# EasyEDA Pro project 南大单个电容计V1.0_SCH.eprj

# Schematic Cap_Meter

## Sheets
1 power
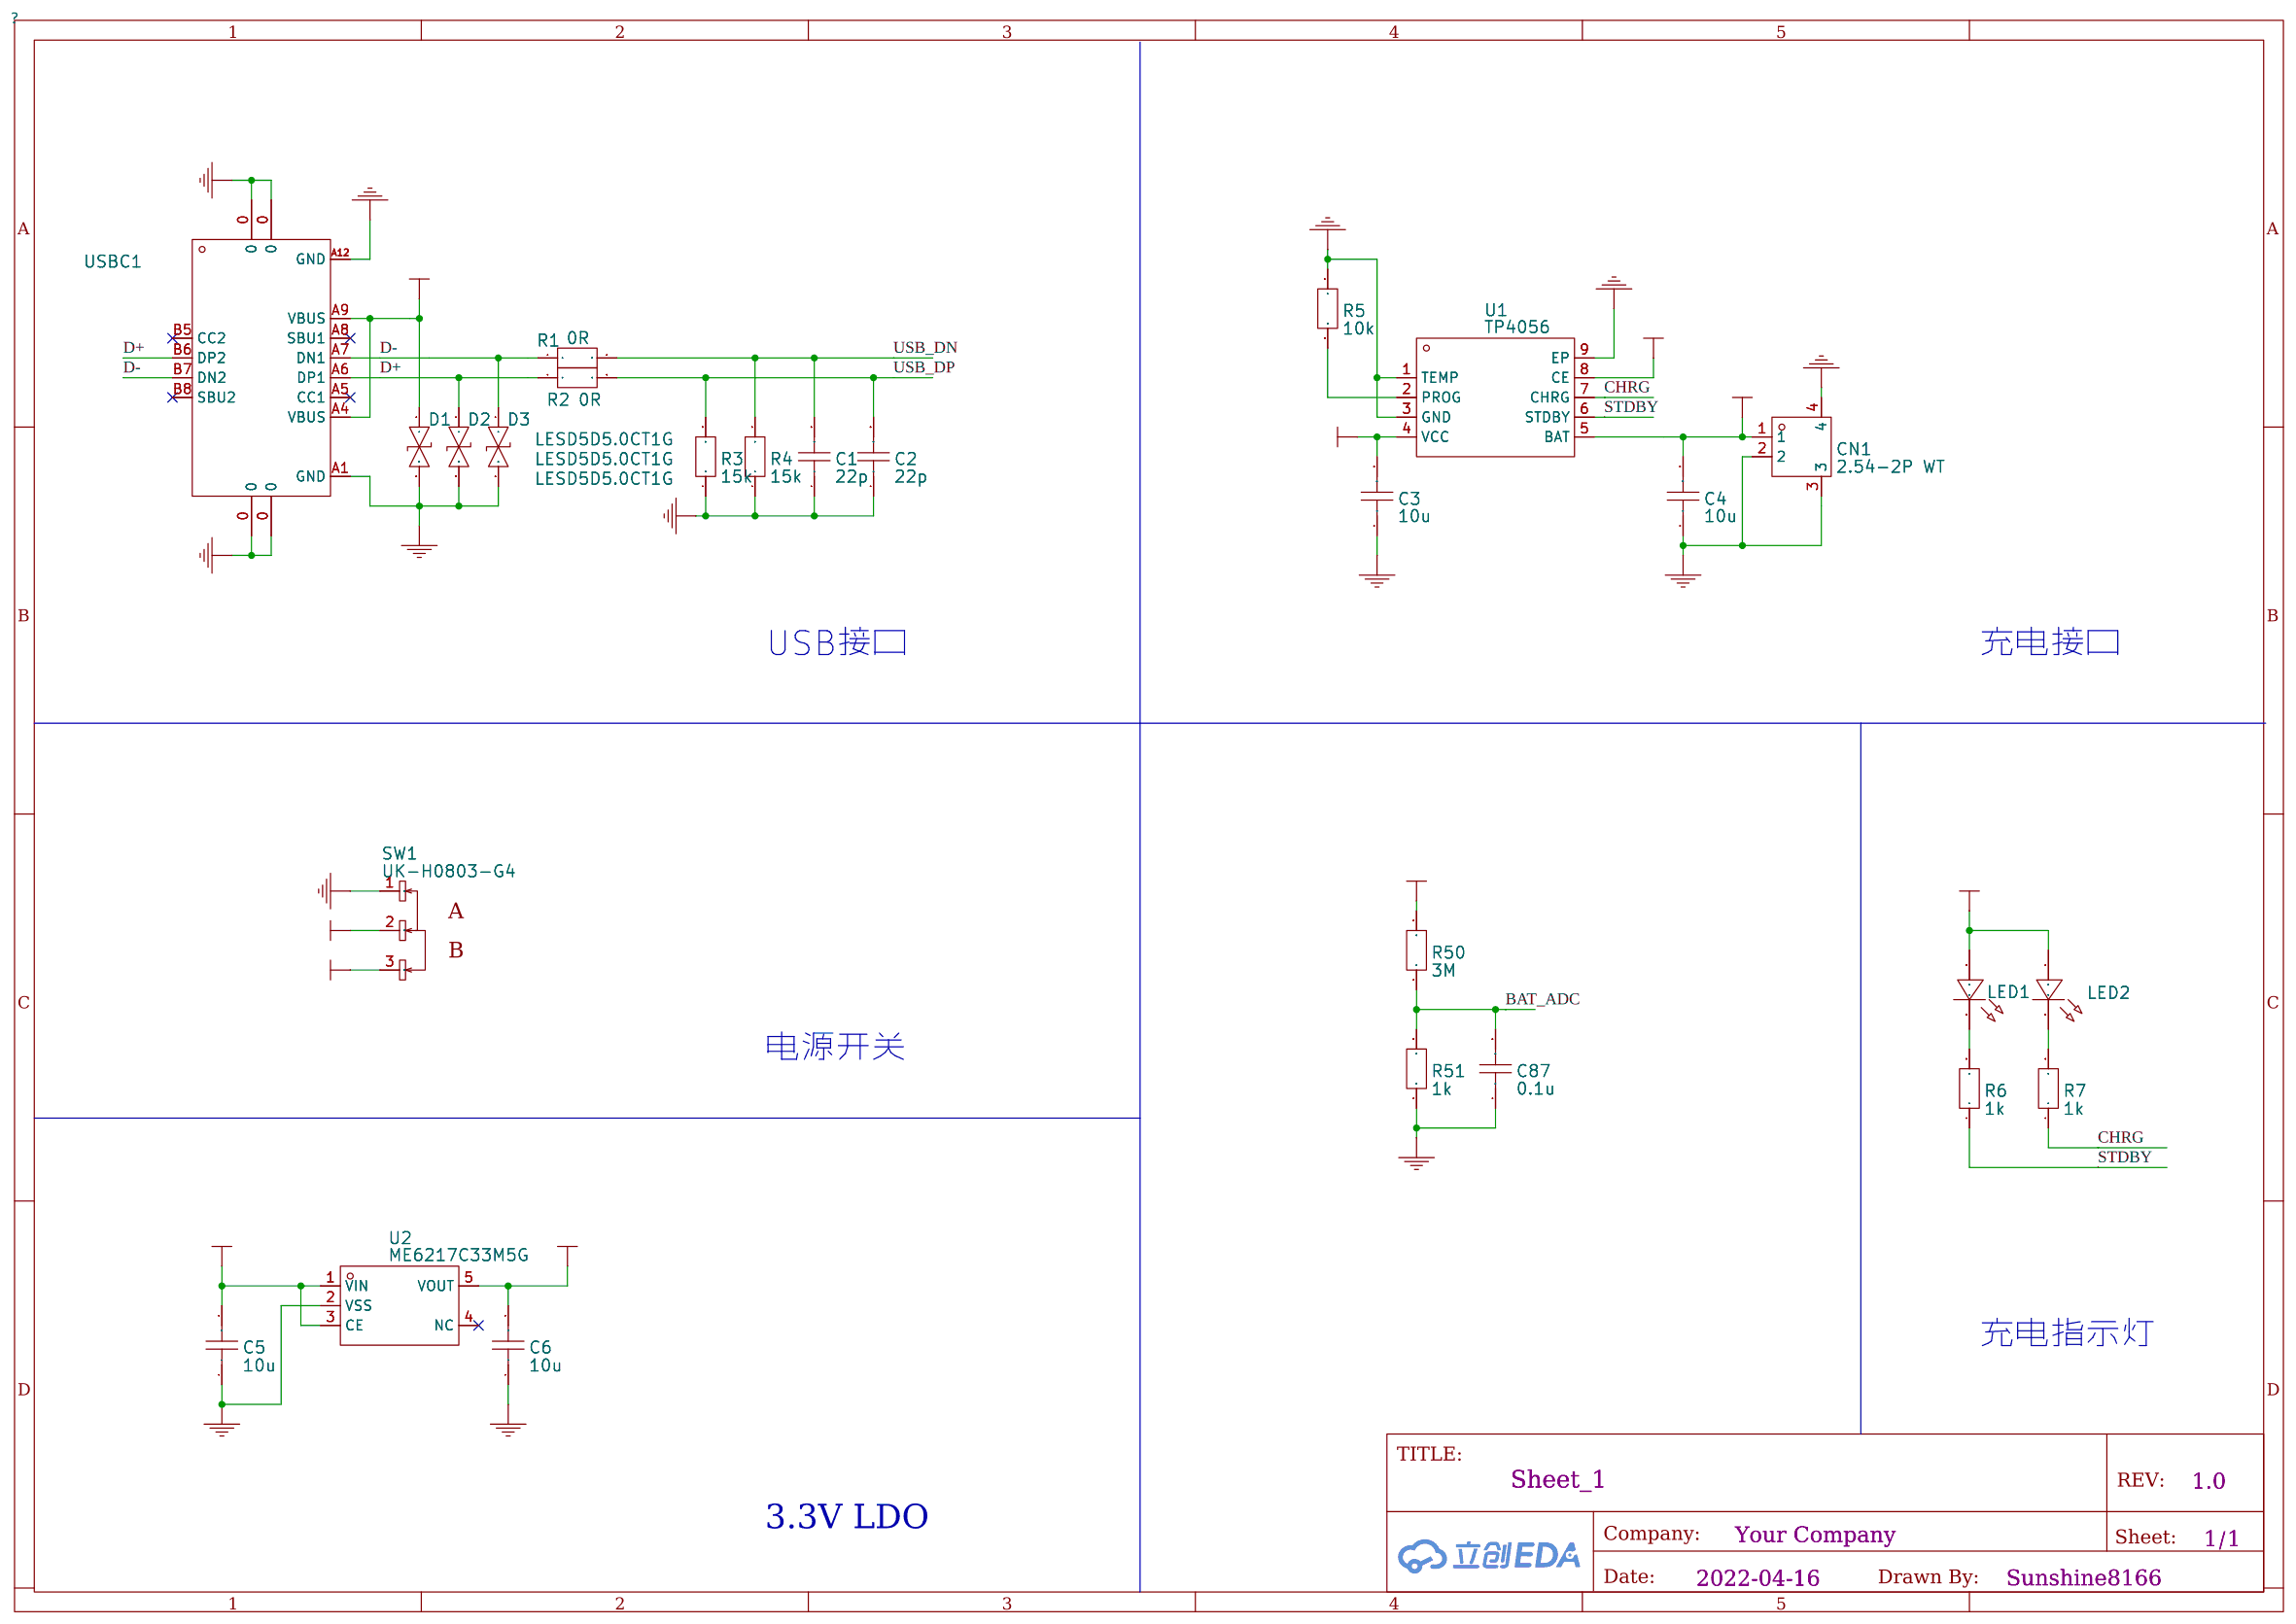
[diagram p0: power]
2 core
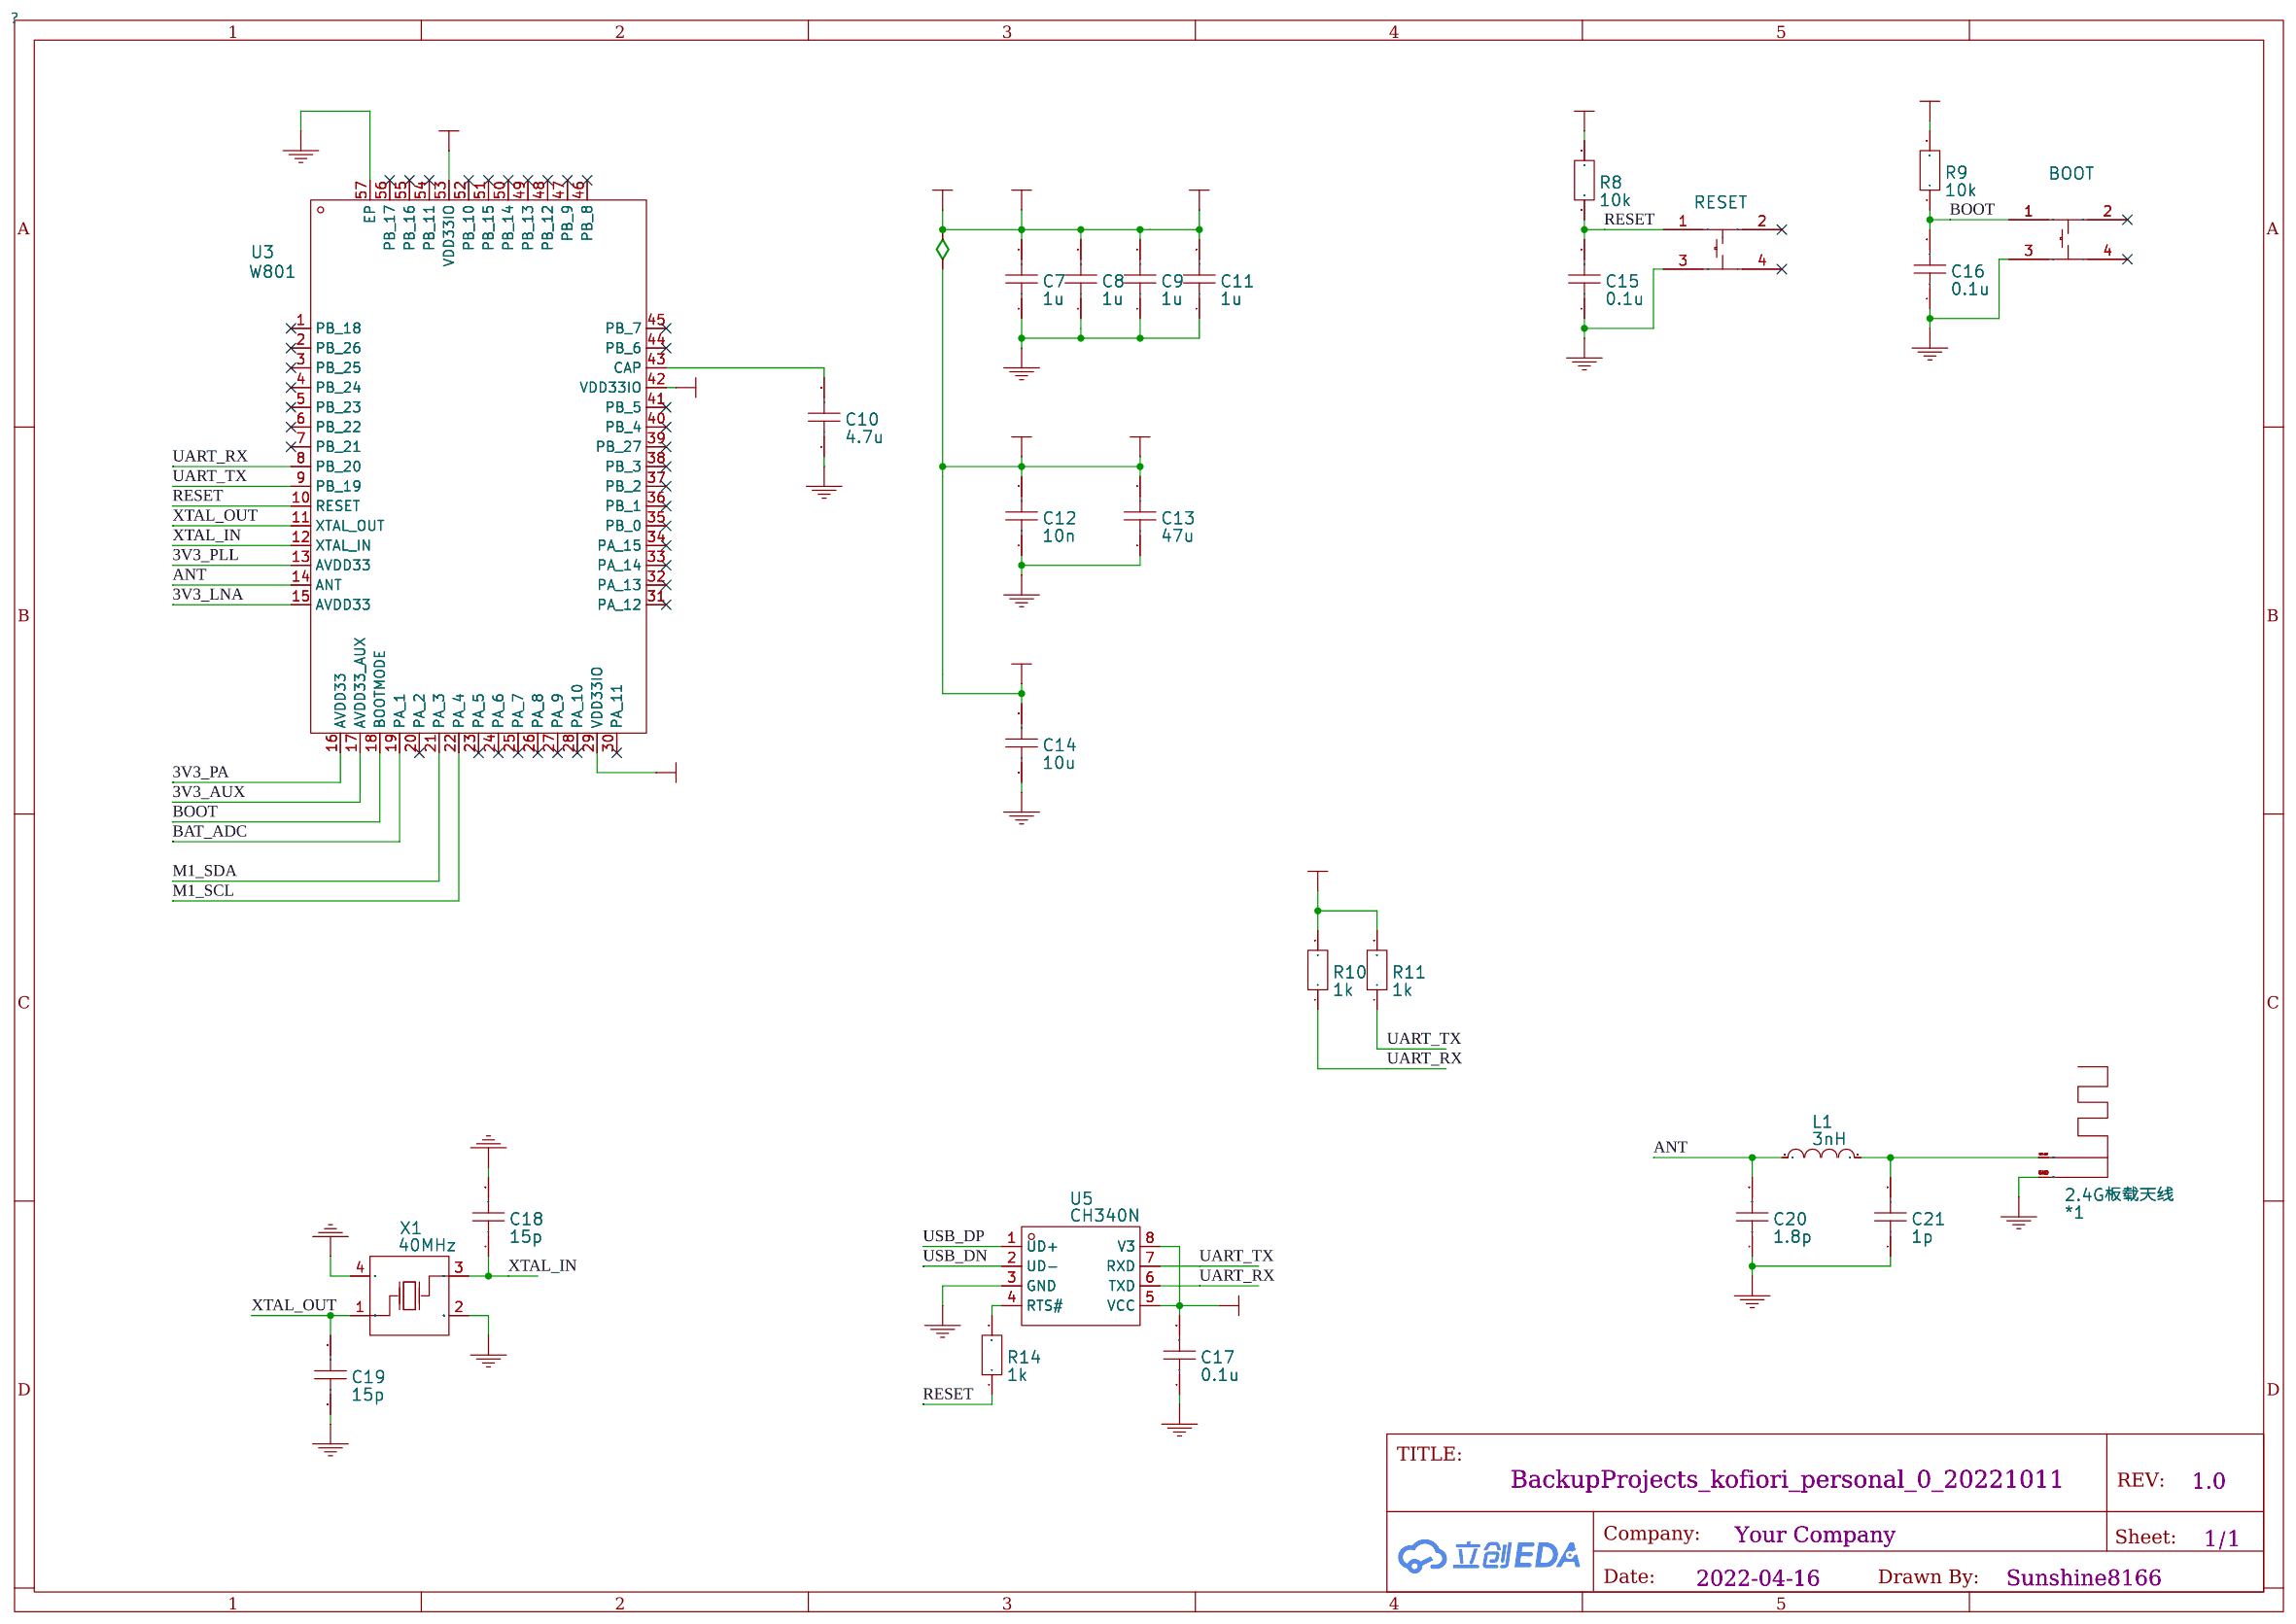
[diagram p1: core]
3 measure1
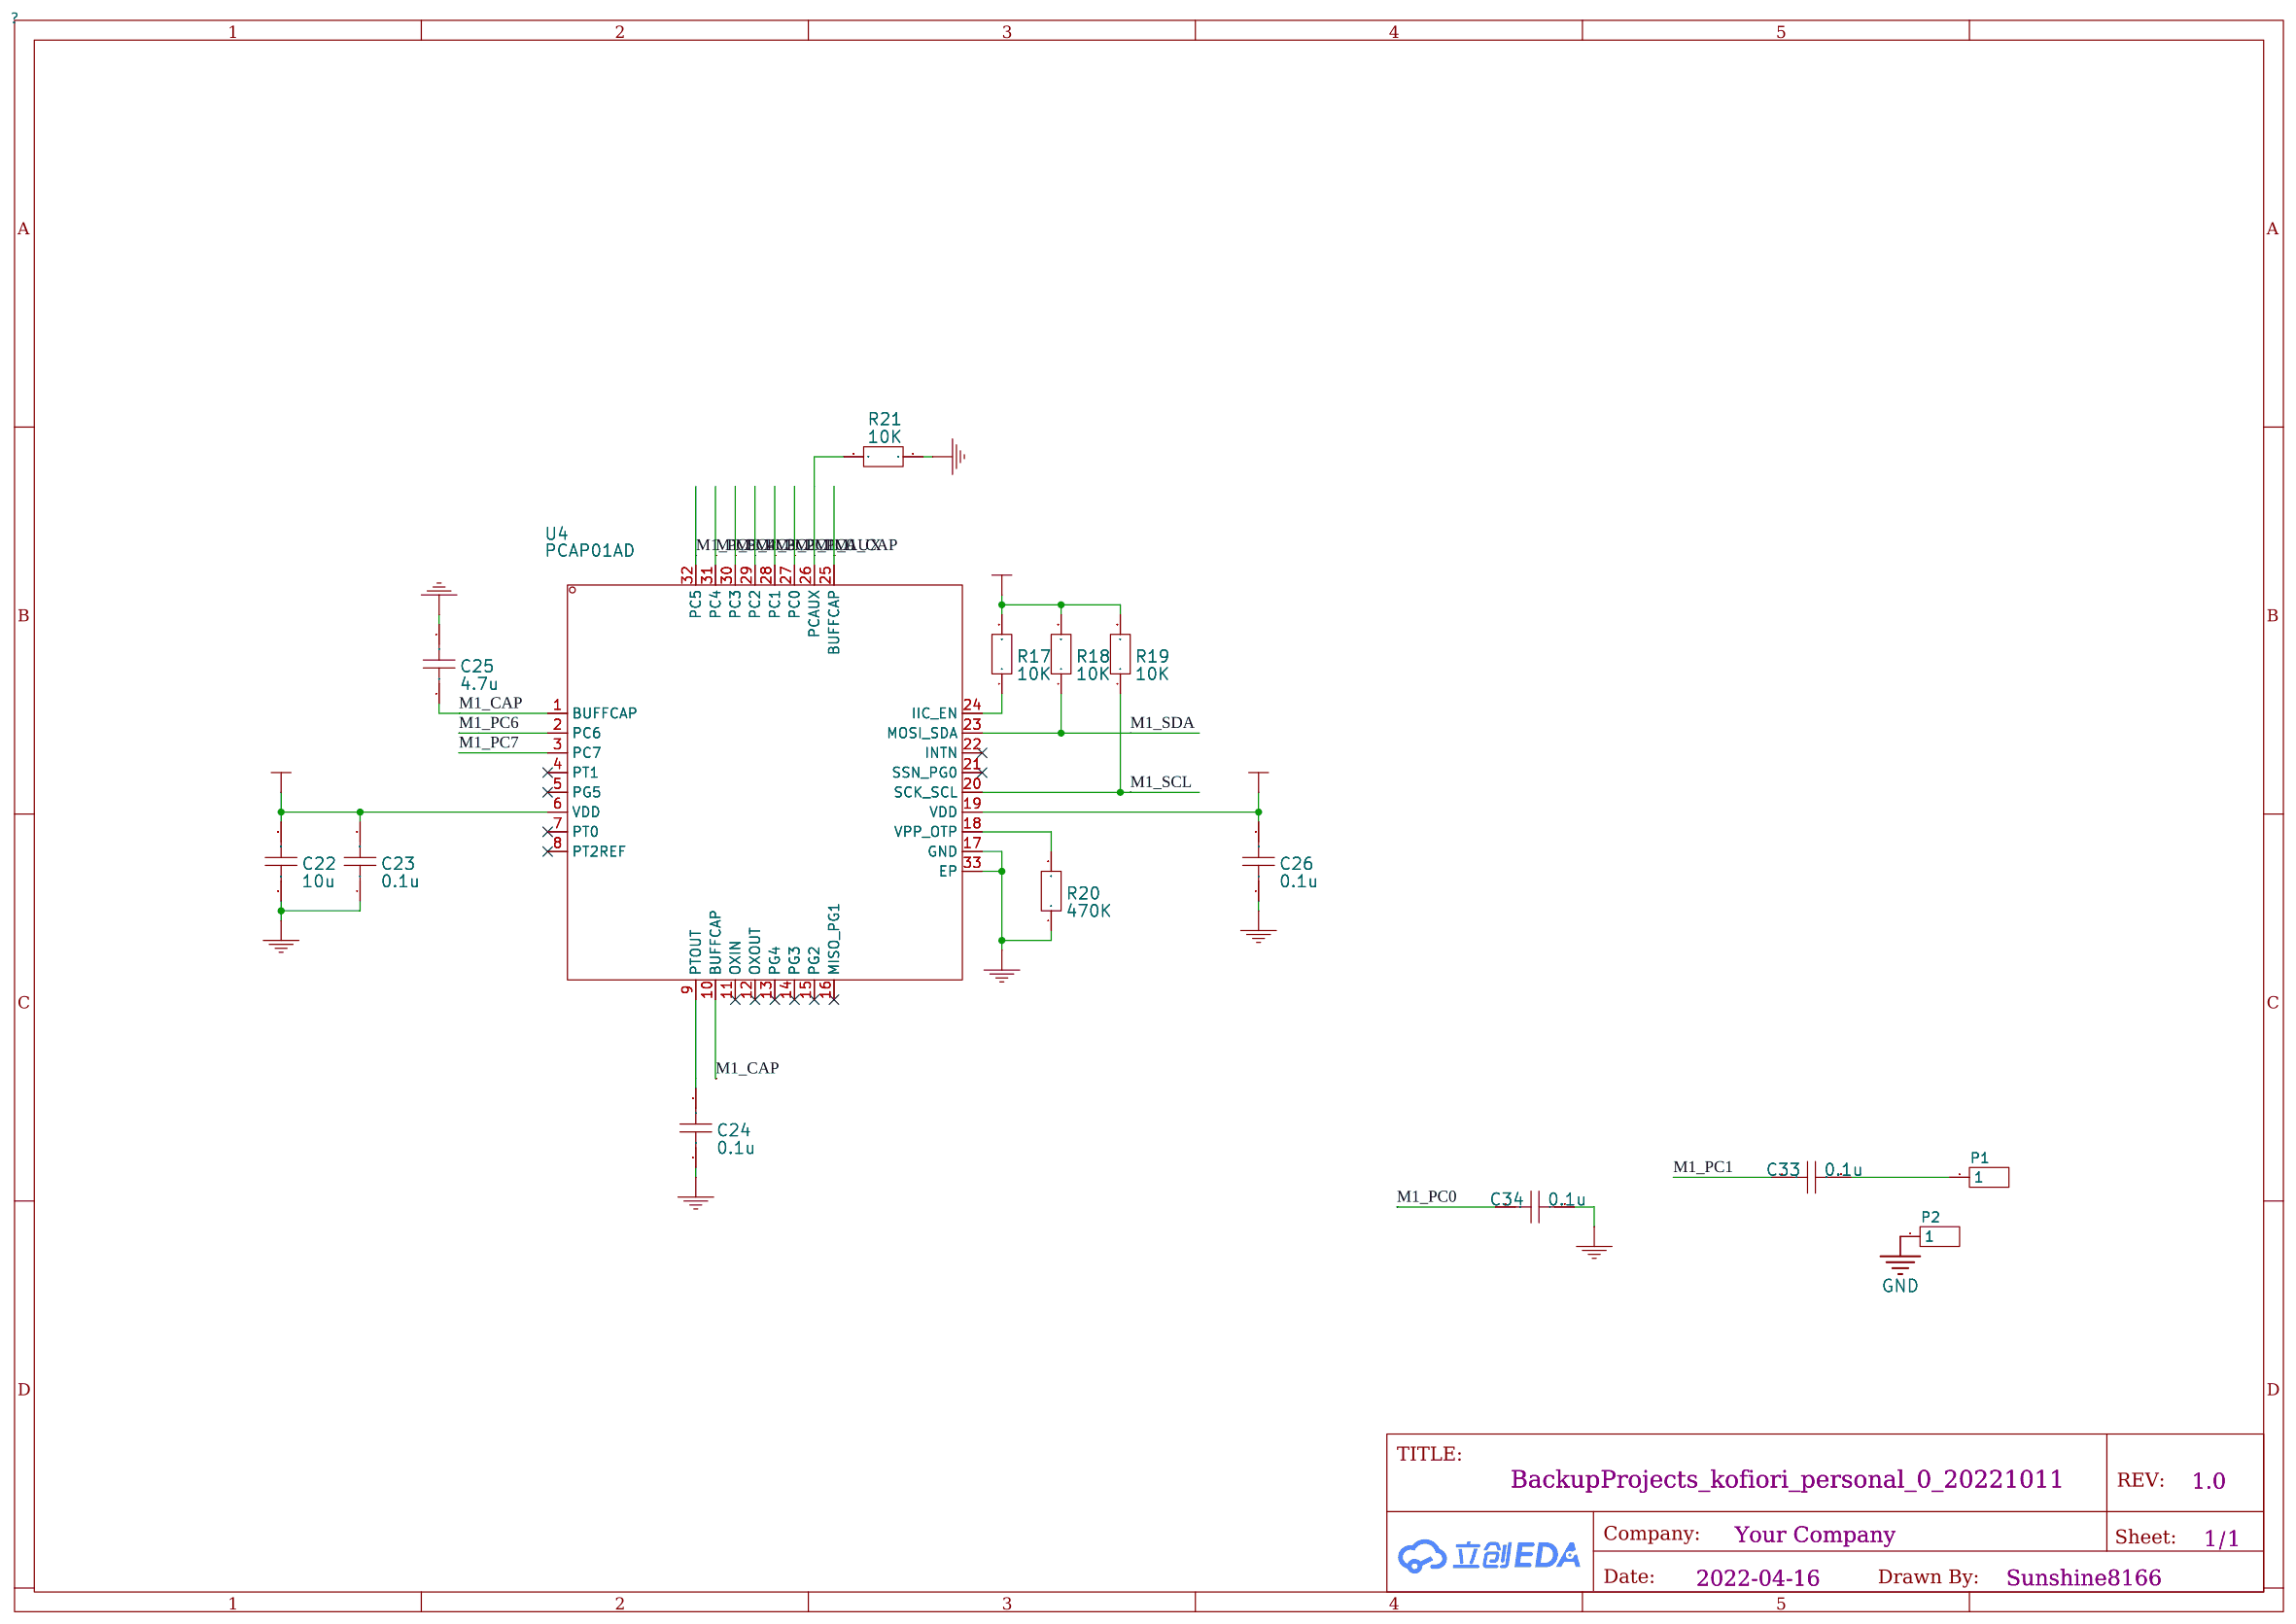
[diagram p2: measure1]

## Parts
sheet core
*1  2.4G板载天线  [2.4G天线（ESP8266板载）左]
BOOT  PTS815SJK250SMTRLFS  [SW-SMD_4P-L4.2-W3.3-P2.15-LS5.1]
C7  1u  [C0402]
C8  1u  [C0402]
C9  1u  [C0402]
C10  4.7u  [C0402]
C11  1u  [C0402]
C12  10n  [C0402]
C13  47u  [C0603]
C14  10u  [C0603]
C15  0.1u  [C0402]
C16  0.1u  [C0402]
C17  0.1u  [C0402]
C18  15p  [C0402]
C19  15p  [C0402]
C20  1.8p  [C0402]
C21  1p  [C0402]
L1  3nH  [L0603]
R8  10k  [R0402]
R9  10k  [R0402]
R10  1k  [R0402]
R11  1k  [R0402]
R14  1k  [R0402]
RESET  PTS815SJK250SMTRLFS  [SW-SMD_4P-L4.2-W3.3-P2.15-LS5.1]
U3  W801  [QFN-56_L6.0-W6.0-P0.35--TL-EP4.7]
U5  CH340N  [SOP-8_L4.9-W3.9-P1.27-LS6.0-BL]
X1  40MHz  [OSC-SMD_4P-L3.2-W2.5-BL_SIT8008BI]
sheet measure1
C22  10u  [C0603]
C23  0.1u  [C0402]
C24  0.1u  [C0402]
C25  4.7u  [C0402]
C26  0.1u  [C0402]
C33  0.1u  [C0402]
C34  0.1u  [C0402]
P1  2.54-1*1P针  [HDR-TH_1P-P2.54-V-M]
P2  2.54-1*1P针  [HDR-TH_1P-P2.54-V-M]
R17  10K  [R0402]
R18  10K  [R0402]
R19  10K  [R0402]
R20  470K  [R0402]
R21  10K  [R0402]
U4  PCAP01AD  [QFN-32_L5.0-W5.0-P0.50-TL-EP]
sheet power
C1  22p  [C0402]
C2  22p  [C0402]
C3  10u  [C0603]
C4  10u  [C0603]
C5  10u  [C0603]
C6  10u  [C0603]
C87  0.1u  [C0402]
CN1  2.54-2P WT  [CONN-SMD_2.54-2PWT]
D1  LESD5D5.0CT1G  [SOD-523_L1.2-W0.8-LS1.6-BI]
D2  LESD5D5.0CT1G  [SOD-523_L1.2-W0.8-LS1.6-BI]
D3  LESD5D5.0CT1G  [SOD-523_L1.2-W0.8-LS1.6-BI]
LED1  LED-0603_G  [LED0603_GREEN]
LED2  LED-0603_R  [LED0603_RED]
R1  0R  [R0402]
R2  0R  [R0402]
R3  15k  [R0402]
R4  15k  [R0402]
R5  10k  [R0402]
R6  1k  [R0402]
R7  1k  [R0402]
R50  3M  [R0402]
R51  1k  [R0402]
SW1  UK-H0803-G4  [SW-TH_3P-L9.1-W3.5-P2.50-A3]
U1  TP4056  [ESOP-8_L4.9-W3.9-P1.27-LS6.0-BL-EP]
U2  ME6217C33M5G  [SOT-23-5_L3.0-W1.7-P0.95-LS2.8-BR]
USBC1  USB3.1C16PFSMT  [USB-C-SMD_TYPE-C-USB-17]

## Library data of the parts
*1 = 2.4G板载天线: Supplier: TTOOAADD
BOOT RESET = PTS815SJK250SMTRLFS: link: https://item.szlcsc.com/457637.html; 3DModel: SW-SMD_4P-L4.2-W3.3-H2.5-P2.15-LS5.1; Supplier: LCSC; Supplier Part: C918859; Manufacturer: C&K; JLCPCB Part Class: Extended Part
C7-C9 C11 = 1u: link: https://item.szlcsc.com/15869.html; 3DModel: C0402_L1.0-W0.5-H0.5
C10 C25 = 4.7u: link: https://item.szlcsc.com/15869.html; 3DModel: C0402_L1.0-W0.5-H0.5
C12 = 10n: link: https://item.szlcsc.com/15869.html; 3DModel: C0402_L1.0-W0.5-H0.5
C13 = 47u: link: https://item.szlcsc.com/362304.html; 3DModel: C0603_L1.6-W0.8-H0.8
C3-C6 C14 C22 = 10u: link: https://item.szlcsc.com/362304.html; 3DModel: C0603_L1.6-W0.8-H0.8
C15-C17 C23 C24 C26 C33 C34 C87 = 0.1u: link: https://item.szlcsc.com/15869.html; 3DModel: C0402_L1.0-W0.5-H0.5
C18 C19 = 15p: link: https://item.szlcsc.com/15869.html; 3DModel: C0402_L1.0-W0.5-H0.5
C20 = 1.8p: link: https://item.szlcsc.com/15869.html; 3DModel: C0402_L1.0-W0.5-H0.5
C21 = 1p: link: https://item.szlcsc.com/15869.html; 3DModel: C0402_L1.0-W0.5-H0.5
L1 = 3nH: link: https://item.szlcsc.com/344093.html; 3DModel: L0603_L1.6-W0.8-H0.5_BEAD
R5 R8 R9 = 10k: link: https://item.szlcsc.com/323315.html; 3DModel: R0402_L1.0-W0.5-H0.5
R6 R7 R10 R11 R14 R51 = 1k: link: https://item.szlcsc.com/323315.html; 3DModel: R0402_L1.0-W0.5-H0.5
U3 = W801: link: https://atta.szlcsc.com/upload/public/pdf/source/20211213/F4F81DC76592C5525AB14E3D832A4B86.pdf; Supplier: LCSC; Supplier Part: C2929888; Manufacturer: WinnerMicro(联盛德); JLCPCB Part Class: Extended Part
U5 = CH340N: link: https://item.szlcsc.com/383602.html; 3DModel: SOP-8_L4.9-W3.9-H1.45-LS6.0-P1.27; Supplier: LCSC; Supplier Part: C2977777; Manufacturer: WCH(南京沁恒); JLCPCB Part Class: Extended Part
X1 = 40MHz: link: https://item.szlcsc.com/264073.html; 3DModel: OSC-SMD_4P-L3.2-W2.5-H1.0; Supplier: LCSC; Manufacturer: YXC; Manufacturer Part: X322540MPB4SI; Supplier Part: C9010; JLCPCB Part Class: Extended Part
P1 P2 = 2.54-1*1P针: 间距:-;总PIN位数:1;排数:1;插针结构:-;行距:-;安装类型:直插;圆针/方针:-;额定电流:-;额定电压:-;配合针长度:-;塑高:-;触头材质:-;触头镀层:-;颜色:黑色;; LCSC Part Name: 直插; Supplier Part: C81276; Manufacturer: BOOMELE(博穆精密); Supplier Footprint: 插件; JLCPCB Part Class: Extended Part; Datasheet: https://atta.szlcsc.comnull; Supplier: LCSC; Number of Pins: 1; Number of Rows: 1; Mounting Type: 直插; Color: 黑色
R17-R19 R21 = 10K: link: https://item.szlcsc.com/323315.html; 3DModel: R0402_L1.0-W0.5-H0.5
R20 = 470K: link: https://item.szlcsc.com/323315.html; 3DModel: R0402_L1.0-W0.5-H0.5
U4 = PCAP01AD: link: https://item.szlcsc.com/18002.html; 3DModel: QFN-32_L5.0-W5.0-H1.0-P0.50-TL-EP; Supplier: LCSC; Supplier Part: C192738; Manufacturer: Ams AG; JLCPCB Part Class: Extended Part
C1 C2 = 22p: link: https://item.szlcsc.com/15869.html; 3DModel: C0402_L1.0-W0.5-H0.5
CN1 = 2.54-2P WT: link: https://item.szlcsc.com/698565.html; 3DModel: CONN-SMD_XH2.50-WS-2P; Supplier: LCSC; Supplier Part: C668622; Manufacturer: SHOU HAN; JLCPCB Part Class: Extended Part
D1-D3 = LESD5D5.0CT1G: link: https://lcsc.com/product-detail/TVS_ESD5Z5V0C_C129211.html; 3DModel: SOD-523_L1.2-W0.8-H0.7-LS1.6; Supplier: LCSC; Supplier Part: C383211; Manufacturer: Leshan Radio; JLCPCB Part Class: Extended Part
LED1 = LED-0603_G: 3DModel: LED0603-RD_GREEN; Manufacturer: EVERLIGHT(台湾亿光); Manufacturer Part: 19-217/GHC-YR1S2/3T; Supplier Part: C72043; Supplier: LCSC
LED2 = LED-0603_R: 3DModel: LED0603_Red; Manufacturer: EVERLIGHT(台湾亿光); Manufacturer Part: 19-217/R6C-AL1M2VY/3T; Supplier Part: C72044; Supplier: LCSC
R1 R2 = 0R: link: https://item.szlcsc.com/323315.html; 3DModel: R0402_L1.0-W0.5-H0.5
R3 R4 = 15k: link: https://item.szlcsc.com/323315.html; 3DModel: R0402_L1.0-W0.5-H0.5
R50 = 3M: link: https://item.szlcsc.com/323315.html; 3DModel: R0402_L1.0-W0.5-H0.5
SW1 = UK-H0803-G4: link: https://item.szlcsc.com/529145.html?ref=editor&logined=true; Supplier: LCSC; Supplier Part: C521449; Manufacturer: USAKRO; JLCPCB Part Class: Extended Part
U1 = TP4056: link: https://www.mornsun.cn/html/pdf/SCM1501B.html; 3DModel: ESOP-8_L4.9-W3.9-H1.6-LS6.0-P1.27; Supplier: LCSC; Supplier Part: C725790; Manufacturer: UMW(Youtai Semiconductor Co., Ltd.); JLCPCB Part Class: Extended Part
U2 = ME6217C33M5G: link: https://item.szlcsc.com/236104.html; 3DModel: SOT-23-5_L2.9-W1.6-H1.1-LS2.8-P0.95; Supplier: LCSC; Supplier Part: C427602; Manufacturer: Nanjing Micro One Elec; JLCPCB Part Class: Extended Part
USBC1 = USB3.1C16PFSMT: link: https://item.szlcsc.com/178704.html; 3DModel: USB-3.1-SMD_16P-L8.9-W7.3-H3.3-P0.5; Supplier: LCSC; Supplier Part: C167321; Manufacturer: LCSC; JLCPCB Part Class: Extended Part

## Nets
3V3: C6.2 C7.2 C8.2 C9.2 C11.2 C12.2 C13.2 C14.2 C17.2 C22.2 C23.2 C26.2 R8.2 R9.2 R10.2 R11.2 R17.2 R18.2 R19.2 U2.5(VOUT) U3.13(AVDD33) U3.15(AVDD33) U3.16(AVDD33) U3.17(AVDD33_AUX) U3.29(VDD33IO) U3.42(VDD33IO) U3.53(VDD33IO) U4.6(VDD) U4.19(VDD) U5.5(VCC) U5.8(V3)
+5V: C3.2 D1.1 LED1.1 LED2.1 U1.4(VCC) U1.8(CE) USBC1.A4(VBUS) USBC1.A9(VBUS)
GND: *1.GND BOOT.3 C1.1 C2.1 C3.1 C4.1 C5.1 C6.1 C7.1 C8.1 C9.1 C10.1 C11.1 C12.1 C13.1 C14.1 C15.1 C16.1 C17.1 C18.2 C19.1 C20.1 C21.1 C22.1 C23.1 C24.1 C25.1 C26.1 C34.2 C87.1 CN1.2 CN1.3 CN1.4 D1.2 D2.2 D3.2 P2.1 R3.1 R4.1 R5.1 R20.1 R21.1 R51.1 RESET.3 SW1.1 U1.1(TEMP) U1.3(GND) U1.9(EP) U2.2(VSS) U3.57(EP) U4.17(GND) U4.33(EP) U5.3(GND) USBC1.0 USBC1.A1(GND) USBC1.A12(GND) X1.2(GND) X1.4(GND)
VCC: C5.2 SW1.2 U2.1(VIN) U2.3(CE)
ANT: C20.2 L1.1 U3.14(ANT)
BAT: C4.2 CN1.1 R50.2 SW1.3 U1.5(BAT)
BAT_ADC: C87.2 R50.1 R51.2 U3.19(PA_1)
BOOT: BOOT.1 C16.2 R9.1 U3.18(BOOTMODE)
CHRG: R7.1 U1.7(CHRG)
D+: D2.1 R2.1 USBC1.A6(DP1) USBC1.B6(DP2)
D-: D3.1 R1.1 USBC1.A7(DN1) USBC1.B7(DN2)
M1_AUX: R21.2 U4.26(PCAUX)
M1_CAP: C25.2 U4.1(BUFFCAP) U4.10(BUFFCAP) U4.25(BUFFCAP)
M1_PC0: C34.1 U4.27(PC0)
M1_PC1: C33.1 U4.28(PC1)
M1_PC2: U4.29(PC2)
M1_PC3: U4.30(PC3)
M1_PC4: U4.31(PC4)
M1_PC5: U4.32(PC5)
M1_PC6: U4.2(PC6)
M1_PC7: U4.3(PC7)
M1_SCL: R19.1 U3.22(PA_4) U4.20(SCK_SCL)
M1_SDA: R18.1 U3.21(PA_3) U4.23(MOSI_SDA)
RESET: C15.2 R8.1 R14.1 RESET.1 U3.10(RESET)
STDBY: R6.1 U1.6(STDBY)
UART_RX: R10.1 U3.8(PB_20) U5.6(TXD)
UART_TX: R11.1 U3.9(PB_19) U5.7(RXD)
USB_DN: C1.2 R1.2 R4.2 U5.2(UD-)
USB_DP: C2.2 R2.2 R3.2 U5.1(UD+)
XTAL_IN: C18.1 U3.12(XTAL_IN) X1.3(OSC2)
XTAL_OUT: C19.2 U3.11(XTAL_OUT) X1.1(OSC1)
$1N357: LED1.2 R6.2
$1N358: LED2.2 R7.2
$1N439: R5.2 U1.2(PROG)
$2N49: C10.2 U3.43(CAP)
$2N323: R14.2 U5.4(RTS#)
$2N442: *1.WIFI-ANT C21.2 L1.2
$3N77: C24.2 U4.9(PTOUT)
$3N118: R17.1 U4.24(IIC_EN)
$3N170: R20.2 U4.18(VPP_OTP)
$3N823: C33.2 P1.1

Not connected (* = marked no-connect by the designer): BOOT 2* 4*; RESET 2* 4*; U2 4(NC)*; U3 1(PB_18)* 2(PB_26)* 3(PB_25)* 4(PB_24)* 5(PB_23)* 6(PB_22)* 7(PB_21)* 20(PA_2)* 23(PA_5)* 24(PA_6)* 25(PA_7)* 26(PA_8)* 27(PA_9)* 28(PA_10)* 30(PA_11)* 31(PA_12)* 32(PA_13)* 33(PA_14)* 34(PA_15)* 35(PB_0)* 36(PB_1)* 37(PB_2)* 38(PB_3)* 39(PB_27)* 40(PB_4)* 41(PB_5)* 44(PB_6)* 45(PB_7)* 46(PB_8)* 47(PB_9)* 48(PB_12)* 49(PB_13)* 50(PB_14)* 51(PB_15)* 52(PB_10)* 54(PB_11)* 55(PB_16)* 56(PB_17)*; U4 4(PT1)* 5(PG5)* 7(PT0)* 8(PT2REF)* 11(OXIN)* 12(OXOUT)* 13(PG4)* 14(PG3)* 15(PG2)* 16(MISO_PG1)* 21(SSN_PG0)* 22(INTN)*; USBC1 A5(CC1)* A8(SBU1)* B5(CC2)* B8(SBU2)*

## Notes on the sheets
sheet 1
- USB接口
- 充电接口
- 电源开关
- 充电指示灯
- 3.3V LDO

# Board 1-PCB_PCB_Cap_Meter
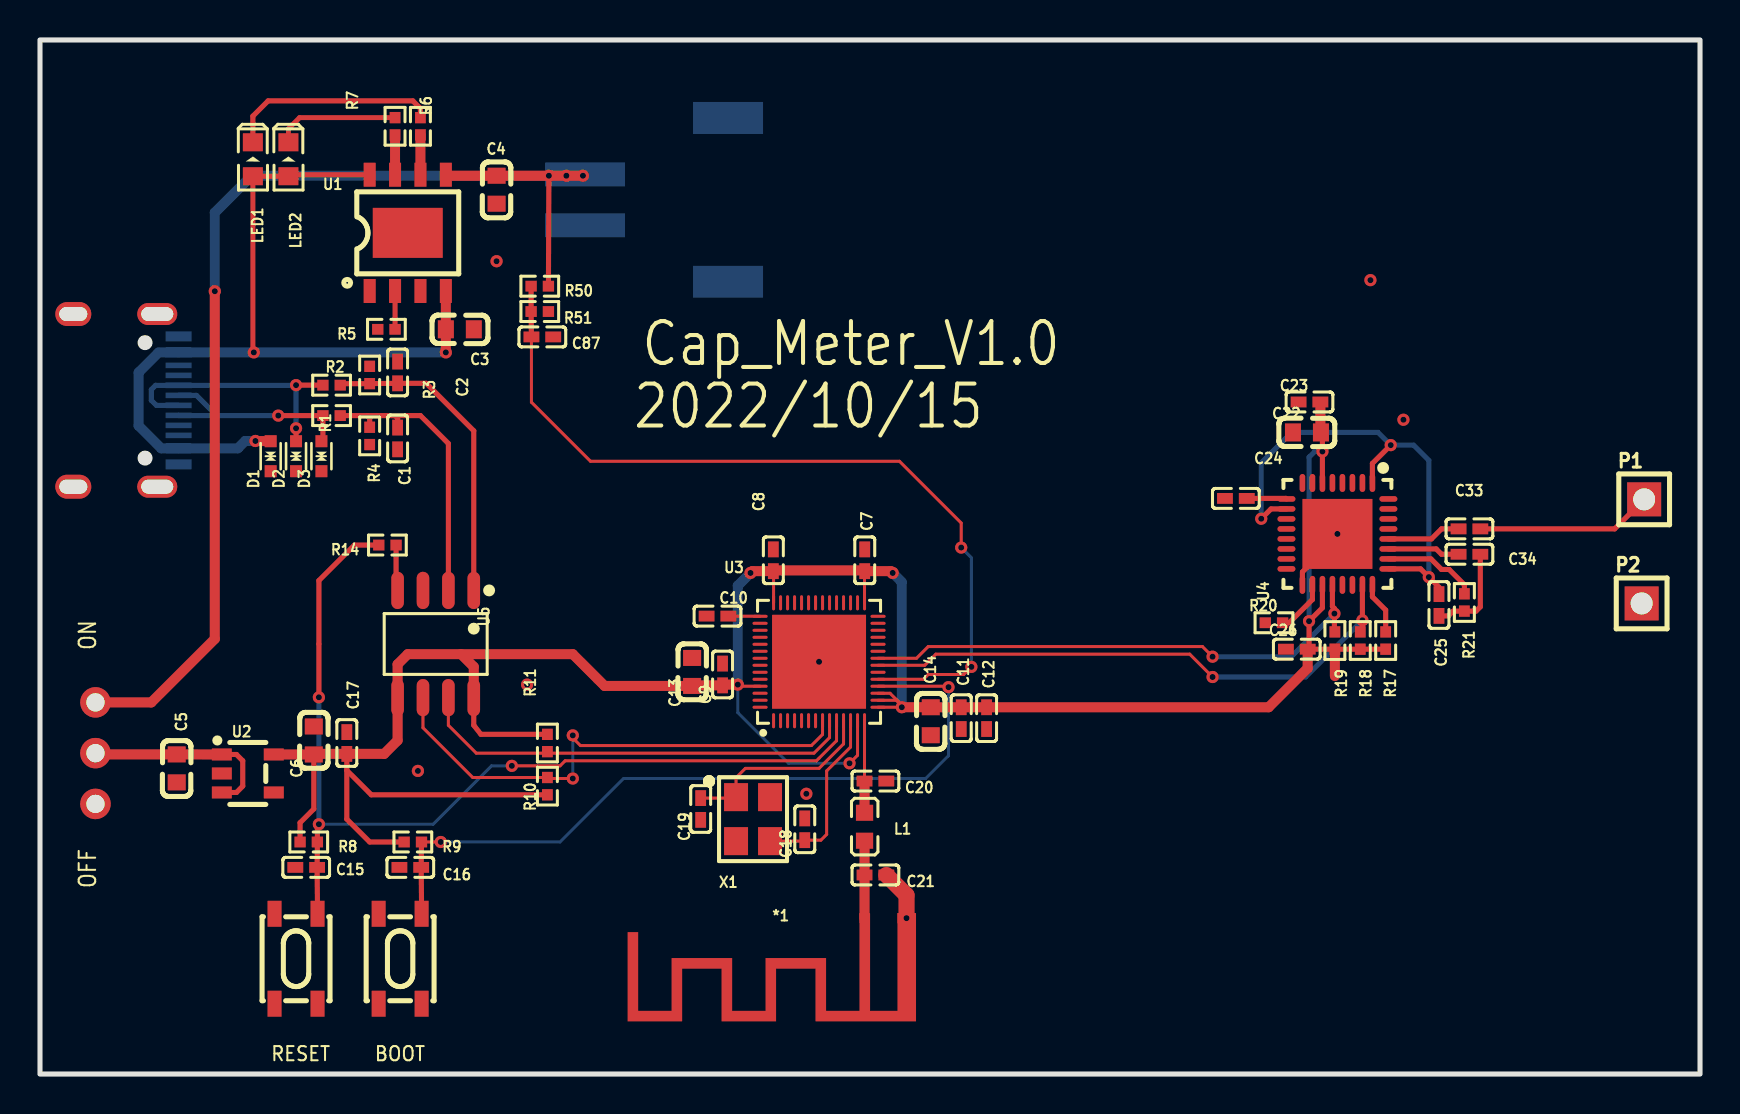
[diagram p3: board, top side]
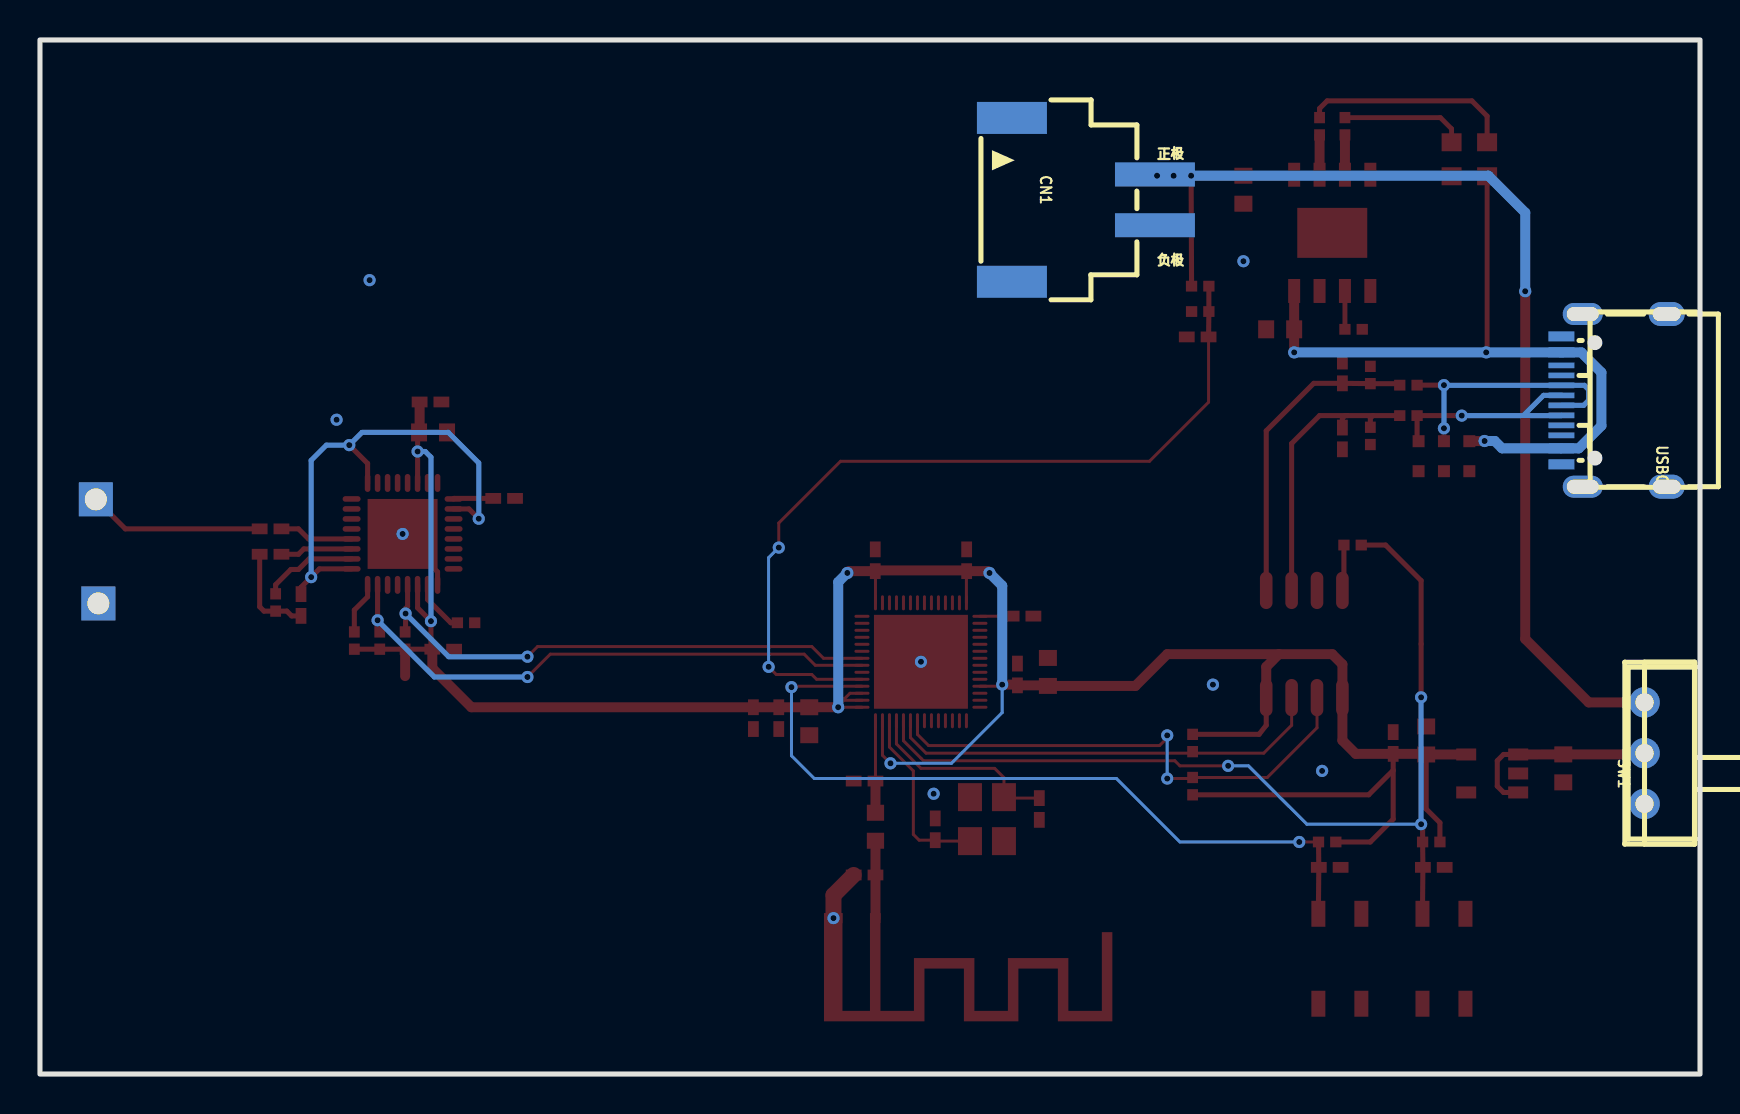
[diagram p4: board, bottom side, seen from below]

Outline 83.04 x 51.74 mm; copper layers: Top Layer, Bottom Layer. Coordinates in mm from the lower left corner of the outline.
Outline path: rectangle 0,51.74 83.04,0
Stack: Top Layer 0.035mm / Dielectric1 1.51mm FR4 er 4.5 / Bottom Layer 0.035mm

## Design rules (mm)
spacing Default (default): track to track 0.152, other pairs 0 to 0.152
track width Default (default): min 0.15, default 0.254, max 25.4
differential pair differentialPair (default): width min 0.127, default 0.254, max 2.54; gap min 0.152, default 0.152
via Default (default): diameter min 0.61, default 0.61, max 100.025; hole min 0.305, default 0.305, max 59.995

## Placement (name value [footprint] x y rotation side)
*1  2.4G板载天线  [2.4G天线（ESP8266板载）左]  30.92 7.8 180 top
BOOT  PTS815SJK250SMTRLFS  [SW-SMD_4P-L4.2-W3.3-P2.15-LS5.1]  18.02 5.77 270 top
C1  22p  [C0402]  17.89 31.8 90 top
C2  22p  [C0402]  17.89 35.11 270 top
C3  10u  [C0603]  21 37.27 180 top
C4  10u  [C0603]  22.84 44.25 90 top
C5  10u  [C0603]  6.84 15.29 90 top
C6  10u  [C0603]  13.7 16.69 270 top
C7  1u  [C0402]  41.26 25.71 270 top
C8  1u  [C0402]  36.68 25.71 270 top
C9  1u  [C0402]  34.14 19.99 270 top
C10  4.7u  [C0402]  33.89 22.91 0 top
C11  1u  [C0402]  46.08 17.81 90 top
C12  10n  [C0402]  47.35 17.81 90 top
C13  47u  [C0603]  32.62 20.12 270 top
C14  10u  [C0603]  44.56 17.65 90 top
C15  0.1u  [C0402]  13.32 10.34 0 top
C16  0.1u  [C0402]  18.52 10.34 0 top
C17  0.1u  [C0402]  15.35 16.56 270 top
C18  15p  [C0402]  38.26 12.25 90 top
C19  15p  [C0402]  33.05 13.26 90 top
C20  1.8p  [C0402]  41.79 14.66 180 top
C21  1p  [C0402]  41.79 9.96 180 top
C22  10u  [C0603]  63.38 32.11 0 top
C23  0.1u  [C0402]  63.5 33.63 0 top
C24  0.1u  [C0402]  59.82 28.8 0 top
C25  4.7u  [C0402]  69.98 23.47 90 top
C26  0.1u  [C0402]  62.87 21.26 0 top
C33  0.1u  [C0402]  71.5 27.28 0 top
C34  0.1u  [C0402]  71.5 26.01 0 top
C87  0.1u  [C0402]  25.13 36.88 180 top
CN1  2.54-2P WT  [CONN-SMD_2.54-2PWT]  30.84 43.74 270 bottom
D1  LESD5D5.0CT1G  [SOD-523_L1.2-W0.8-LS1.6-BI]  11.54 30.92 270 top
D2  LESD5D5.0CT1G  [SOD-523_L1.2-W0.8-LS1.6-BI]  12.81 30.92 270 top
D3  LESD5D5.0CT1G  [SOD-523_L1.2-W0.8-LS1.6-BI]  14.08 30.92 270 top
L1  3nH  [L0603]  41.25 12.37 270 top
LED1  LED-0603_G  [LED0603_GREEN]  10.65 45.77 90 top
LED2  LED-0603_R  [LED0603_RED]  12.43 45.77 90 top
P1  2.54-1*1P针  [HDR-TH_1P-P2.54-V-M]  80.25 28.76 0 top
P2  2.54-1*1P针  [HDR-TH_1P-P2.54-V-M]  80.12 23.55 0 top
R1  0R  [R0402]  14.59 32.95 0 top
R2  0R  [R0402]  14.59 34.47 0 top
R3  15k  [R0402]  16.49 34.98 270 top
R4  15k  [R0402]  16.49 31.93 90 top
R5  10k  [R0402]  17.33 37.26 0 top
R6  1k  [R0402]  19.03 47.42 90 top
R7  1k  [R0402]  17.76 47.42 90 top
R8  10k  [R0402]  13.44 11.61 180 top
R9  10k  [R0402]  18.65 11.61 180 top
R10  1k  [R0402]  25.38 14.41 270 top
R11  1k  [R0402]  25.38 16.56 90 top
R14  1k  [R0402]  17.38 26.47 0 top
R17  10K  [R0402]  67.31 21.69 270 top
R18  10K  [R0402]  66.04 21.69 270 top
R19  10K  [R0402]  64.77 21.69 270 top
R20  470K  [R0402]  61.73 22.58 0 top
R21  10K  [R0402]  71.25 23.6 90 top
R50  3M  [R0402]  25 39.42 0 top
R51  1k  [R0402]  25 38.15 180 top
RESET  PTS815SJK250SMTRLFS  [SW-SMD_4P-L4.2-W3.3-P2.15-LS5.1]  12.81 5.77 270 top
SW1  UK-H0803-G4  [SW-TH_3P-L9.1-W3.5-P2.50-A3]  2.78 16.06 90 bottom
U1  TP4056  [ESOP-8_L4.9-W3.9-P1.27-LS6.0-BL-EP]  18.4 42.09 0 top
U2  ME6217C33M5G  [SOT-23-5_L3.0-W1.7-P0.95-LS2.8-BR]  10.4 15.04 180 top
U3  W801  [QFN-56_L6.0-W6.0-P0.35--TL-EP4.7]  38.97 20.63 90 top
U4  PCAP01AD  [QFN-32_L5.0-W5.0-P0.50-TL-EP]  64.9 27.03 270 top
U5  CH340N  [SOP-8_L4.9-W3.9-P1.27-LS6.0-BL]  19.79 21.52 180 top
USBC1  USB3.1C16PFSMT  [USB-C-SMD_TYPE-C-USB-17]  4.3 33.71 90 bottom
X1  40MHz  [OSC-SMD_4P-L3.2-W2.5-BL_SIT8008BI]  35.67 12.75 270 top

## Footprints (pads in the part's own frame, mm; a bottom-side part is the same pattern mirrored in y, then rotated)
2.4G天线（ESP8266板载）左
  rect 0.9x0.5 smd: GND(-12.425,0)
  rect 0.5x0.5 smd: WIFI-ANT(-10.325,0)
C0402
  rect 0.79x0.54 smd: 1(-0.545,0) 2(0.545,0)
C0603
  rect 0.8x0.9 smd: 1(-0.7,0) 2(0.7,0)
CONN-SMD_2.54-2PWT
  rect 1.2x4 smd: 1(-1.27,3.577) 2(1.27,3.577)
  rect 1.6x3.5 smd: 3(4.1,-3.577) 4(-4.1,-3.577)
ESOP-8_L4.9-W3.9-P1.27-LS6.0-BL-EP
  rect 0.6x1.2 smd: 1(-1.905,-2.909) 2(-0.635,-2.909) 3(0.635,-2.909) 4(1.905,-2.909) 5(1.905,2.909) 6(0.635,2.909) 7(-0.635,2.909) 8(-1.905,2.909)
  rect 3.5x2.5 smd: 9(0,0)
HDR-TH_1P-P2.54-V-M
  rect 1.7x1.7 hole 1.1: 1(0,0)
L0603
  rect 0.8x0.864 smd: 1(-0.7,0.001) 2(0.7,0.001)
LED0603_GREEN
  rect 0.9x1 smd: 1(-0.85,0) 2(0.85,0)
LED0603_RED
  rect 0.9x1 smd: 1(-0.85,0) 2(0.85,0)
OSC-SMD_4P-L3.2-W2.5-BL_SIT8008BI
  rect 1.4x1.2 smd: 1(-1.1,-0.85) 2(1.1,-0.85) 3(1.1,0.85) 4(-1.1,0.85)
QFN-32_L5.0-W5.0-P0.50-TL-EP
  oval 0.9x0.28 smd: 1(-2.55,1.75) 2(-2.55,1.25) 3(-2.55,0.75) 4(-2.55,0.25) 5(-2.55,-0.25) 6(-2.55,-0.75) 7(-2.55,-1.25) 8(-2.55,-1.75) 17(2.55,-1.75) 18(2.55,-1.25) 19(2.55,-0.75) 20(2.55,-0.25) 21(2.55,0.25) 22(2.55,0.75) 23(2.55,1.25) 24(2.55,1.75)
  oval 0.28x0.9 smd: 9(-1.75,-2.55) 10(-1.25,-2.55) 11(-0.75,-2.55) 12(-0.25,-2.55) 13(0.25,-2.55) 14(0.75,-2.55) 15(1.25,-2.55) 16(1.75,-2.55) 25(1.75,2.55) 26(1.25,2.55) 27(0.75,2.55) 28(0.25,2.55) 29(-0.25,2.55) 30(-0.75,2.55) 31(-1.25,2.55) 32(-1.75,2.55)
  rect 3.5x3.5 smd: 33(0,0)
QFN-56_L6.0-W6.0-P0.35--TL-EP4.7
  oval 0.755x0.15 smd: 1(-2.95,2.275) 2(-2.95,1.925) 3(-2.95,1.575) 4(-2.95,1.225) 5(-2.95,0.875) 6(-2.95,0.525) 7(-2.95,0.175) 8(-2.95,-0.175) 9(-2.95,-0.525) 10(-2.95,-0.875) 11(-2.95,-1.225) 12(-2.95,-1.575) 13(-2.95,-1.925) 14(-2.95,-2.275) 29(2.95,-2.275) 30(2.95,-1.925) 31(2.95,-1.575) 32(2.95,-1.225) 33(2.95,-0.875) 34(2.95,-0.525) 35(2.95,-0.175) 36(2.95,0.175) 37(2.95,0.525) 38(2.95,0.875) 39(2.95,1.225) 40(2.95,1.575) 41(2.95,1.925) 42(2.95,2.275)
  oval 0.15x0.755 smd: 15(-2.275,-2.95) 16(-1.925,-2.95) 17(-1.575,-2.95) 18(-1.225,-2.95) 19(-0.875,-2.95) 20(-0.525,-2.95) 21(-0.175,-2.95) 22(0.175,-2.95) 23(0.525,-2.95) 24(0.875,-2.95) 25(1.225,-2.95) 26(1.575,-2.95) 27(1.925,-2.95) 28(2.275,-2.95) 43(2.275,2.95) 44(1.925,2.95) 45(1.575,2.95) 46(1.225,2.95) 47(0.875,2.95) 48(0.525,2.95) 49(0.175,2.95) 50(-0.175,2.95) 51(-0.525,2.95) 52(-0.875,2.95) 53(-1.225,2.95) 54(-1.575,2.95) 55(-1.925,2.95) 56(-2.275,2.95)
  rect 4.7x4.7 smd: 57(0,0)
R0402
  rect 0.566x0.54 smd: 1(-0.432,0) 2(0.433,0)
SOD-523_L1.2-W0.8-LS1.6-BI
  rect 0.6x0.6 smd: 1(-0.75,0) 2(0.75,0)
SOP-8_L4.9-W3.9-P1.27-LS6.0-BL
  oval 0.63x1.865 smd: 1(-1.905,-2.683) 2(-0.635,-2.683) 3(0.635,-2.683) 4(1.905,-2.683) 5(1.905,2.683) 6(0.635,2.683) 7(-0.635,2.683) 8(-1.905,2.683)
SOT-23-5_L3.0-W1.7-P0.95-LS2.8-BR
  rect 1x0.6 smd: 1(1.3,-0.95) 2(1.3,0) 3(1.3,0.95) 4(-1.3,0.95) 5(-1.3,-0.95)
SW-SMD_4P-L4.2-W3.3-P2.15-LS5.1
  rect 1.3x0.7 smd: 1(-2.25,1.075) 2(2.25,1.075) 3(-2.25,-1.075) 4(2.25,-1.075)
SW-TH_3P-L9.1-W3.5-P2.50-A3
  round 1.524 hole 0.914: 1(-2.54,0) 2(0,0) 3(2.54,0)
USB-C-SMD_TYPE-C-USB-17
  oval 1.2x1.8 hole 0.7x1.4: 0(-4.32,-2.634) 1(4.32,-2.634)
  oval 1.1x2 hole 0.7x1.6: 2(4.32,1.566) 3(-4.32,1.566)
  rect 0.5x1.3 smd: A1(-3.2,2.633) A4(-2.4,2.633) A9(2.4,2.634) A12(3.2,2.633)
  rect 0.28x1.3 smd: A5(-1.25,2.633) A6(-0.25,2.633) A7(0.25,2.633) A8(1.25,2.634) B5(1.75,2.633) B6(0.75,2.633) B7(-0.75,2.633) B8(-1.75,2.634)

## Nets
As in the schematic, except:
3V3: C6.2 C7.2 C8.2 C9.2 C11.2 C12.2 C13.2 C14.2 C17.2 C22.2 C23.2 C26.2 R8.2 R9.2 R10.2 R11.2 R17.2 R18.2 R19.2 U2.5 U3.29 U3.42 U3.53 U4.6 U4.19 U5.5 U5.8

Pads without a net: BOOT 2 4; RESET 2 4; U2 4; U3 1 2 3 4 5 6 7 20 23 24 25 26 27 28 30 31 32 33 34 35 36 37 38 39 40 41 44 45 46 47 48 49 50 51 52 54 55 56; U4 4 5 7 8 11 12 13 14 15 16 21 22; USBC1 1 2 3 A5 A8 B5 B8

## Via types
v1: diameter 0.61, hole 0.305, Top Layer to Bottom Layer, 42 vias

## Routing (per net, layer and track width the routed paths; a pad name or vN(x,y) marks a point on that pad's centre or on a via; arc(x,y) is an arc through that point)
3V3: length 140.9
  Top Layer w0.15: 40.9,17.68 40.9,15.95 v1(40.49,15.55) ; 41.92,18.35 v1(43.11,18.35) ; 43.22,18.35 42.52,19.05 41.92,19.05 ; C9.2 34.14,19.4 36.02,19.4 ; U3.29 41.25,25.07 ; 41.92,18.7 42.83,18.7 43.18,18.35 ; U3.42 36.7,25.07
  Top Layer w0.254: U4.6 v1(64.15,31.15) 64.15,32.03 ; R9.2 16.49,11.61 15.35,12.75 15.35,15.2 ; 64.77,21.26 R18.2 R17.2 ; R11.2 22.06,17 21.7,17.45 U5.8 ; R10.2 16.57,13.97 15.35,15.2 ; C23.2 64.08,33.6 ; 15.35,15.2 C17.2 ; R19.2 C26.2 63.48,21.33 v1(63.48,22.66) 64.15,23.33 64.15,24.48 ; C6.2 13.7,13.26 13.01,12.58 13.01,11.61
  Top Layer w0.5: 44.56,18.35 v1(43.11,18.35) ; C14.2 C11.2 C12.2 61.46,18.35 63.41,20.31 C26.2 ; 36.68,25.2 41.18,25.2 ; R19.2 64.77,19.91 ; C22.2 64.05,32.13 C23.2 ; U5.8 21.7,20.38 21.07,21.01 ; U2.5 13.7,15.99 ; C7.2 42.56,25.16 42.65,25.07 ; v1(35.54,25.07) 35.63,25.16 C8.2 ; v1(34.91,19.49) 34.18,19.49 C9.2 32.65,19.45 C13.2 28.24,19.42 26.65,21.01 21.07,21.01 ; 21.07,21.01 18.4,21.01 17.89,20.5 U5.5 17.89,16.69 17.22,16.02 C17.2 13.73,16.02 C6.2
  Bottom Layer w0.15: 40.49,15.55 37.45,15.55 34.91,18.09 34.91,19.48
  Bottom Layer w0.254: v1(64.15,31.15) 63.77,31.15 63.48,30.87 v1(63.48,22.66)
  Bottom Layer w0.5: v1(35.54,25.07) 34.91,24.44 v1(34.91,19.49) ; 42.65,25.07 43.11,24.62 43.11,18.35
  vias: v1(42.65,25.07)
+5V: length 43.5
  Top Layer w0.245: v1(10.7,36.11) 10.65,36.16 LED1.1 LED2.1 12.5,45 U1.8
  Top Layer w0.5: U1.4 C3.2 v1(20.3,36.11) ; 10.78,31.68 11.54,31.67
  Bottom Layer w0.5: 6.93,31.31 6.06,31.31 4.93,32.44 4.93,35.11 5.94,36.11 6.93,36.11 ; USBC1.A4 9.9,31.31 10.27,31.68 v1(10.78,31.68) ; USBC1.A9 v1(10.7,36.11) v1(20.3,36.11)
GND: length 8.4
  Top Layer w0.254: 72.05,26.01 72.05,23.38 71.83,23.16 R21.1 70.69,23.16 70.45,22.92 C25.1 ; 63.35,25.33 63.15,25.12 U4.17
  Top Layer w0.8: v1(43.35,7.8) 43.35,8.95 C21.1
  vias: v1(18.9,15.17) v1(22.84,40.67) v1(24.37,19.49) v1(38.34,14.02) v1(38.97,20.63) v1(64.9,27.03) v1(66.55,39.73) v1(68.2,32.74)
VCC: length 10
  Top Layer w0.254: U2.1 9.83,15.99 10.14,15.68 10.14,14.41 9.83,14.09 U2.3
  Top Layer w0.5: U2.1 C5.2 2.84,15.99 SW1.2
ANT: length 4.6
  Top Layer w0.15: U3.14 C20.2
  Top Layer w0.5: C20.2 L1.1
BAT: length 58.5
  Top Layer w0.254: v1(25.46,44.95) R50.2
  Top Layer w0.5: U1.5 20.35,44.95 C4.2 v1(25.46,44.95) v1(26.33,44.95) v1(27.16,44.95) ; v1(8.74,39.17) 8.74,21.77 5.57,18.6 SW1.3
  Bottom Layer w0.5: v1(8.74,39.17) 8.74,43.11 10.59,44.95 v1(25.46,44.95)
BAT_ADC: length 42.1
  Top Layer w0.15: 42.99,30.66 46.08,27.57 v1(46.08,26.34) ; U3.19 44.19,19.75 44.43,19.99 46.21,19.99 v1(46.59,20.37) ; 42.99,30.66 27.54,30.66 24.58,33.62 C87.2
  Top Layer w0.254: C87.2 R51.2 R50.1
  Bottom Layer w0.15: v1(46.59,20.37) 46.59,25.84 v1(46.08,26.34)
BOOT: length 38.7
  Top Layer w0.15: U3.18 45.4,19.4 v1(45.45,19.36) ; R9.1 v1(20.05,11.61)
  Top Layer w0.254: R9.1 19.07,10.34 19.09,8.02
  Bottom Layer w0.15: v1(45.45,19.36) 45.45,15.93 44.3,14.79 29.19,14.79 26.02,11.61 v1(20.05,11.61)
CHRG: length 2
  Top Layer w0.5: 17.76,45 R7.1
D+: length 13.4
  Top Layer w0.254: v1(12.81,34.47) R2.1 ; D2.1 12.81,32.19
  Bottom Layer w0.254: v1(12.81,32.31) v1(12.81,34.47) 12.81,34.46 5.78,34.46 5.57,34.25 5.57,33.71 5.82,33.46 6.93,33.46
D-: length 10.8
  Top Layer w0.254: v1(11.92,32.95) R1.1 14.15,31.74 D3.1
  Bottom Layer w0.254: USBC1.B7 6.94,32.95 v1(11.92,32.95) ; 8.83,32.96 7.83,33.96 USBC1.A7
M1_AUX: length 4.8
  Top Layer w0.254: U4.26 69.58,25.78 70.11,25.25 70.49,25.25 71.25,24.49 71.25,24.03
M1_CAP: length 25.2
  Top Layer w0.254: U4.25 69.06,25.28 v1(69.47,24.87) 69.98,24.36 C25.2 ; v1(61.09,27.79) 61.58,28.28 62.35,28.28 ; v1(67.57,31.47) 66.65,30.55 U4.1
  Bottom Layer w0.254: v1(69.47,24.87) 69.47,30.71 68.71,31.47 v1(67.57,31.47) 66.93,32.11 62.62,32.11 61.09,30.58 v1(61.09,27.79)
M1_PC0: length 3.6
  Top Layer w0.254: C34.1 70.11,26.01 69.84,26.28 U4.27
M1_PC1: length 3.7
  Top Layer w0.254: C33.1 70.11,27.28 69.6,26.78 U4.28
M1_SCL: length 26.6
  Top Layer w0.15: v1(58.66,20.88) 58.15,21.39 44.43,21.39 43.84,20.8 U3.22
  Top Layer w0.254: 64.65,24.48 64.65,23.4 64.75,23.3 v1(64.75,23.04) 64.75,22.15 64.77,22.12
  Bottom Layer w0.254: v1(64.75,23.04) 62.59,20.88 v1(58.66,20.88)
M1_SDA: length 28.6
  Top Layer w0.15: U3.21 44.26,20.45 44.81,21.01 57.51,21.01 v1(58.66,19.87)
  Top Layer w0.254: U4.23 v1(66.15,22.71) 66.15,22.12 R18.1
  Bottom Layer w0.254: v1(58.66,19.87) 63.31,19.87 v1(66.15,22.71)
RESET: length 49.1
  Top Layer w0.15: 23.6,15.42 26.02,15.42 26.27,15.67 38.84,15.67 38.97,15.8 ; 38.97,15.8 39.85,16.68 U3.10
  Top Layer w0.254: v1(13.95,12.5) 13.88,12.42 R8.1 13.86,10.34 RESET.1 ; v1(13.95,18.85) 13.95,24.69 15.73,26.47 R14.1
  Bottom Layer w0.15: v1(13.95,12.5) 19.67,12.5 22.59,15.42 v1(23.6,15.42)
  Bottom Layer w0.254: v1(13.95,18.85) v1(13.95,12.5)
STDBY: length 2
  Top Layer w0.5: 19.03,45 R6.1
UART_RX: length 25.9
  Top Layer w0.15: 26.65,16.94 26.65,16.82 27.03,16.44 38.59,16.44 39.14,16.99 39.14,17.68 ; U5.6 19.16,17.33 21.65,14.84 R10.1 25.43,14.79 v1(26.65,14.79)
  Bottom Layer w0.15: v1(26.65,14.79) v1(26.65,16.95)
UART_TX: length 22.2
  Top Layer w0.15: U5.7 20.43,17.45 21.82,16.06 38.72,16.06 39.5,16.84 U3.9
USB_DN: length 14.8
  Top Layer w0.254: 20.43,24.2 20.43,31.55 19.03,32.95 17.61,32.95 ; 15.02,32.95 16.36,32.95 ; 16.36,32.95 17.76,32.95 17.89,32.82 C1.2 ; 16.36,32.95 16.49,32.82 R4.2
USB_DP: length 15.7
  Top Layer w0.254: U5.1 21.7,32.19 19.32,34.56 C2.2 R3.2 15.09,34.55 15.02,34.47
XTAL_IN: length 9.2
  Top Layer w0.15: X1.3 38.21,11.65 38.26,11.7 39.06,11.7 39.35,11.99 39.35,15.17 40.55,16.36 U3.12
XTAL_OUT: length 10
  Top Layer w0.15: 35.28,15.29 34.82,14.83 X1.1 34.77,13.81 C19.2 ; U3.11 40.2,16.52 38.97,15.29 35.29,15.29
$1N357: length 10.6
  Top Layer w0.254: R6.2 19.03,48.32 18.65,48.7 11.41,48.7 10.65,47.93 LED1.2
$1N358: length 6.2
  Top Layer w0.245: LED2.2 12.43,47.3 12.99,47.86 R7.2
$1N439: length 1.9
  Top Layer w0.245: U1.2 R5.2
$2N49: length 1.6
  Top Layer w0.15: 36.02,22.9 C10.2
$2N323: length 2.3
  Top Layer w0.254: U5.4 17.81,24.28 17.81,26.47
$2N442: length 3.9
  Top Layer w0.5: L1.2 C21.2 41.25,7.8
$3N77: length 2
  Top Layer w0.254: C24.2 62.32,28.8 62.35,28.78
$3N118: length 2.6
  Top Layer w0.254: R17.1 67.31,23.22 66.65,23.88 U4.24
$3N170: length 2.7
  Top Layer w0.254: R20.2 62.49,22.58 63.65,23.74 U4.18
$3N823: length 8.8
  Top Layer w0.254: P1.1 78.77,27.28 72.05,27.28

## Copper pours and planes (outline as drawn; the poured copper is in the pictures)
GND on Top Layer: -11.96,54.79 94.09,54.79 94.09,-3.63 -11.96,-3.63
GND on Bottom Layer: -24.15,56.44 109.96,56.44 109.96,-1.22 -24.15,-1.22

## Text on the board
Bottom Silkscreen Layer: 正极 | 负极
Top Silkscreen Layer: ON | OFF | 2022/10/15 | Cap_Meter_V1.0
